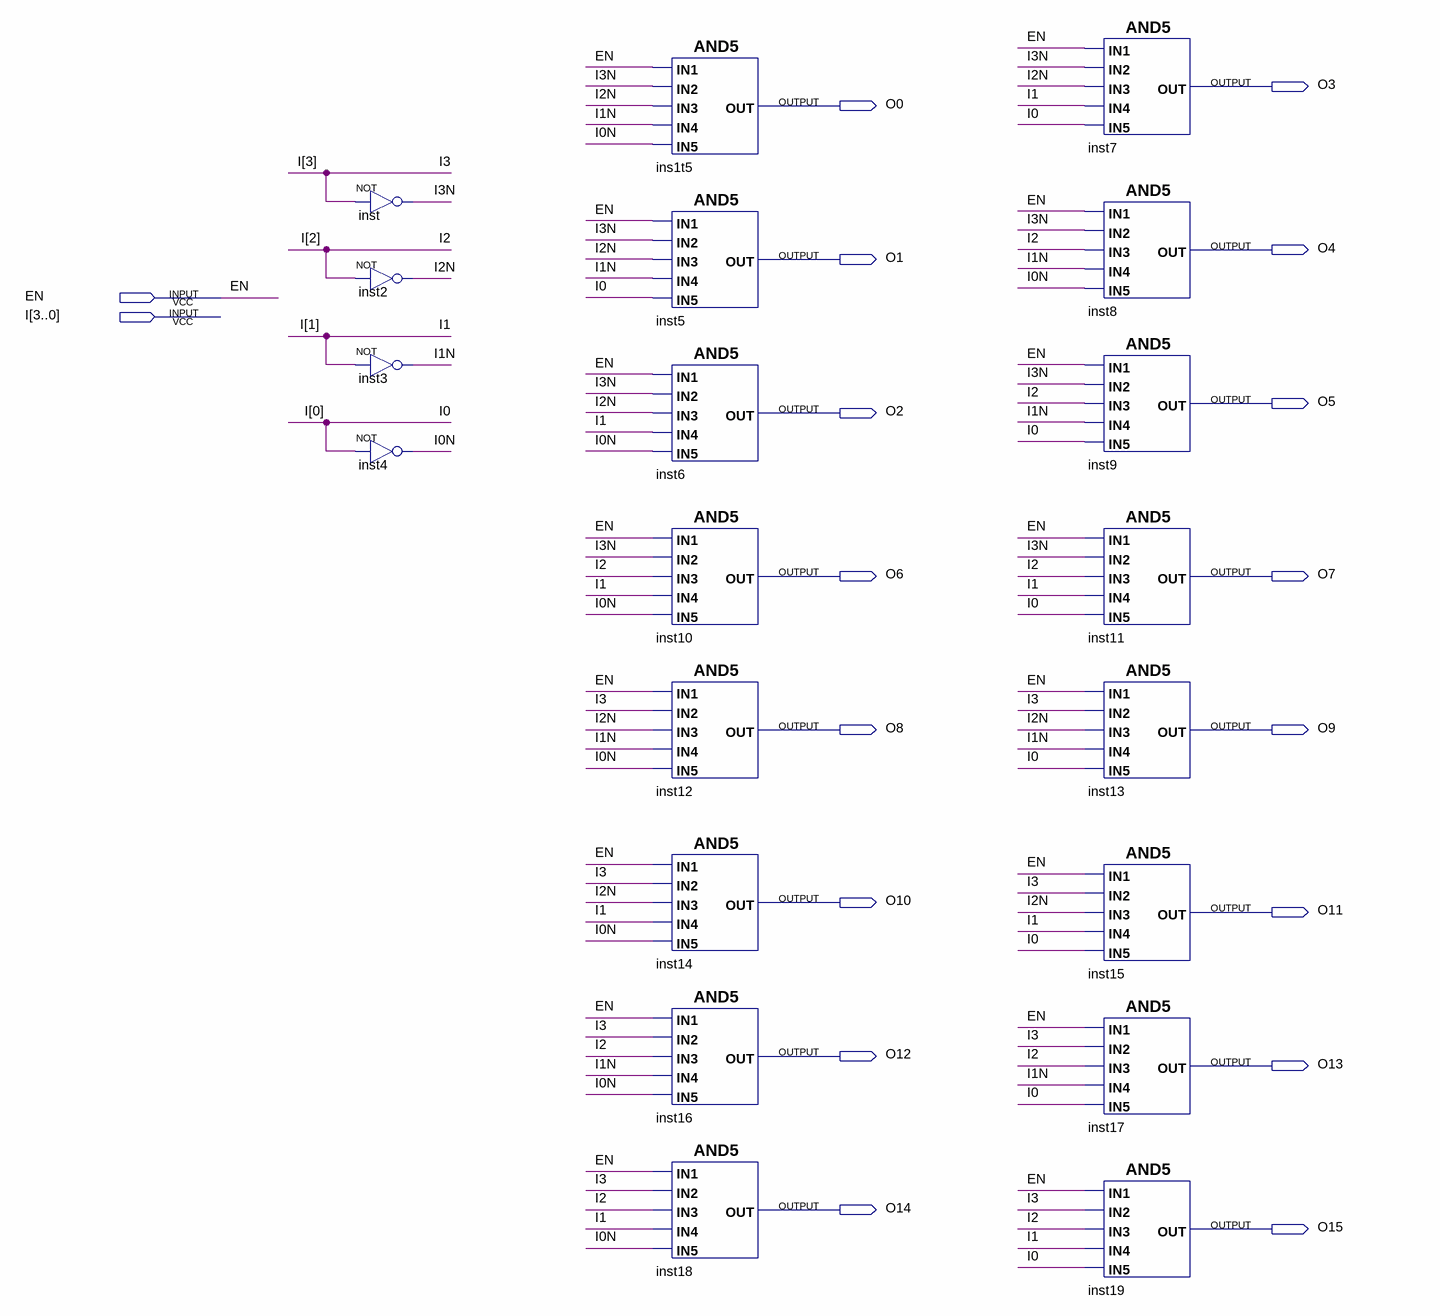
[diagram p0: schematic sheet]
// Quartus schematic DECODER4_16.bdf as structural Verilog: 20 symbols, 18 pins
module DECODER4_16 (
  input  EN,
  input  [3:0] I,
  output O3,
  output O0,
  output O4,
  output O1,
  output O5,
  output O2,
  output O6,
  output O7,
  output O8,
  output O9,
  output O10,
  output O11,
  output O12,
  output O13,
  output O14,
  output O15
);

  wire I0N, I1N, I2N, I3N;

  not inst (I3N, I[3]);
  not inst2 (I2N, I[2]);
  not inst3 (I1N, I[1]);
  not inst4 (I0N, I[0]);
  and ins1t5 (O0, EN, I3N, I2N, I1N, I0N);
  and inst5 (O1, EN, I3N, I2N, I1N, I[0]);
  and inst6 (O2, EN, I3N, I2N, I[1], I0N);
  and inst10 (O6, EN, I3N, I[2], I[1], I0N);
  and inst12 (O8, EN, I[3], I2N, I1N, I0N);
  and inst14 (O10, EN, I[3], I2N, I[1], I0N);
  and inst16 (O12, EN, I[3], I[2], I1N, I0N);
  and inst18 (O14, EN, I[3], I[2], I[1], I0N);
  and inst7 (O3, EN, I3N, I2N, I[1], I[0]);
  and inst8 (O4, EN, I3N, I[2], I1N, I0N);
  and inst9 (O5, EN, I3N, I[2], I1N, I[0]);
  and inst11 (O7, EN, I3N, I[2], I[1], I[0]);
  and inst13 (O9, EN, I[3], I2N, I1N, I[0]);
  and inst15 (O11, EN, I[3], I2N, I[1], I[0]);
  and inst17 (O13, EN, I[3], I[2], I1N, I[0]);
  and inst19 (O15, EN, I[3], I[2], I[1], I[0]);
endmodule
